# EAGLE design I2C_PWM_DRV_1.0.a (EAGLE 5.10)
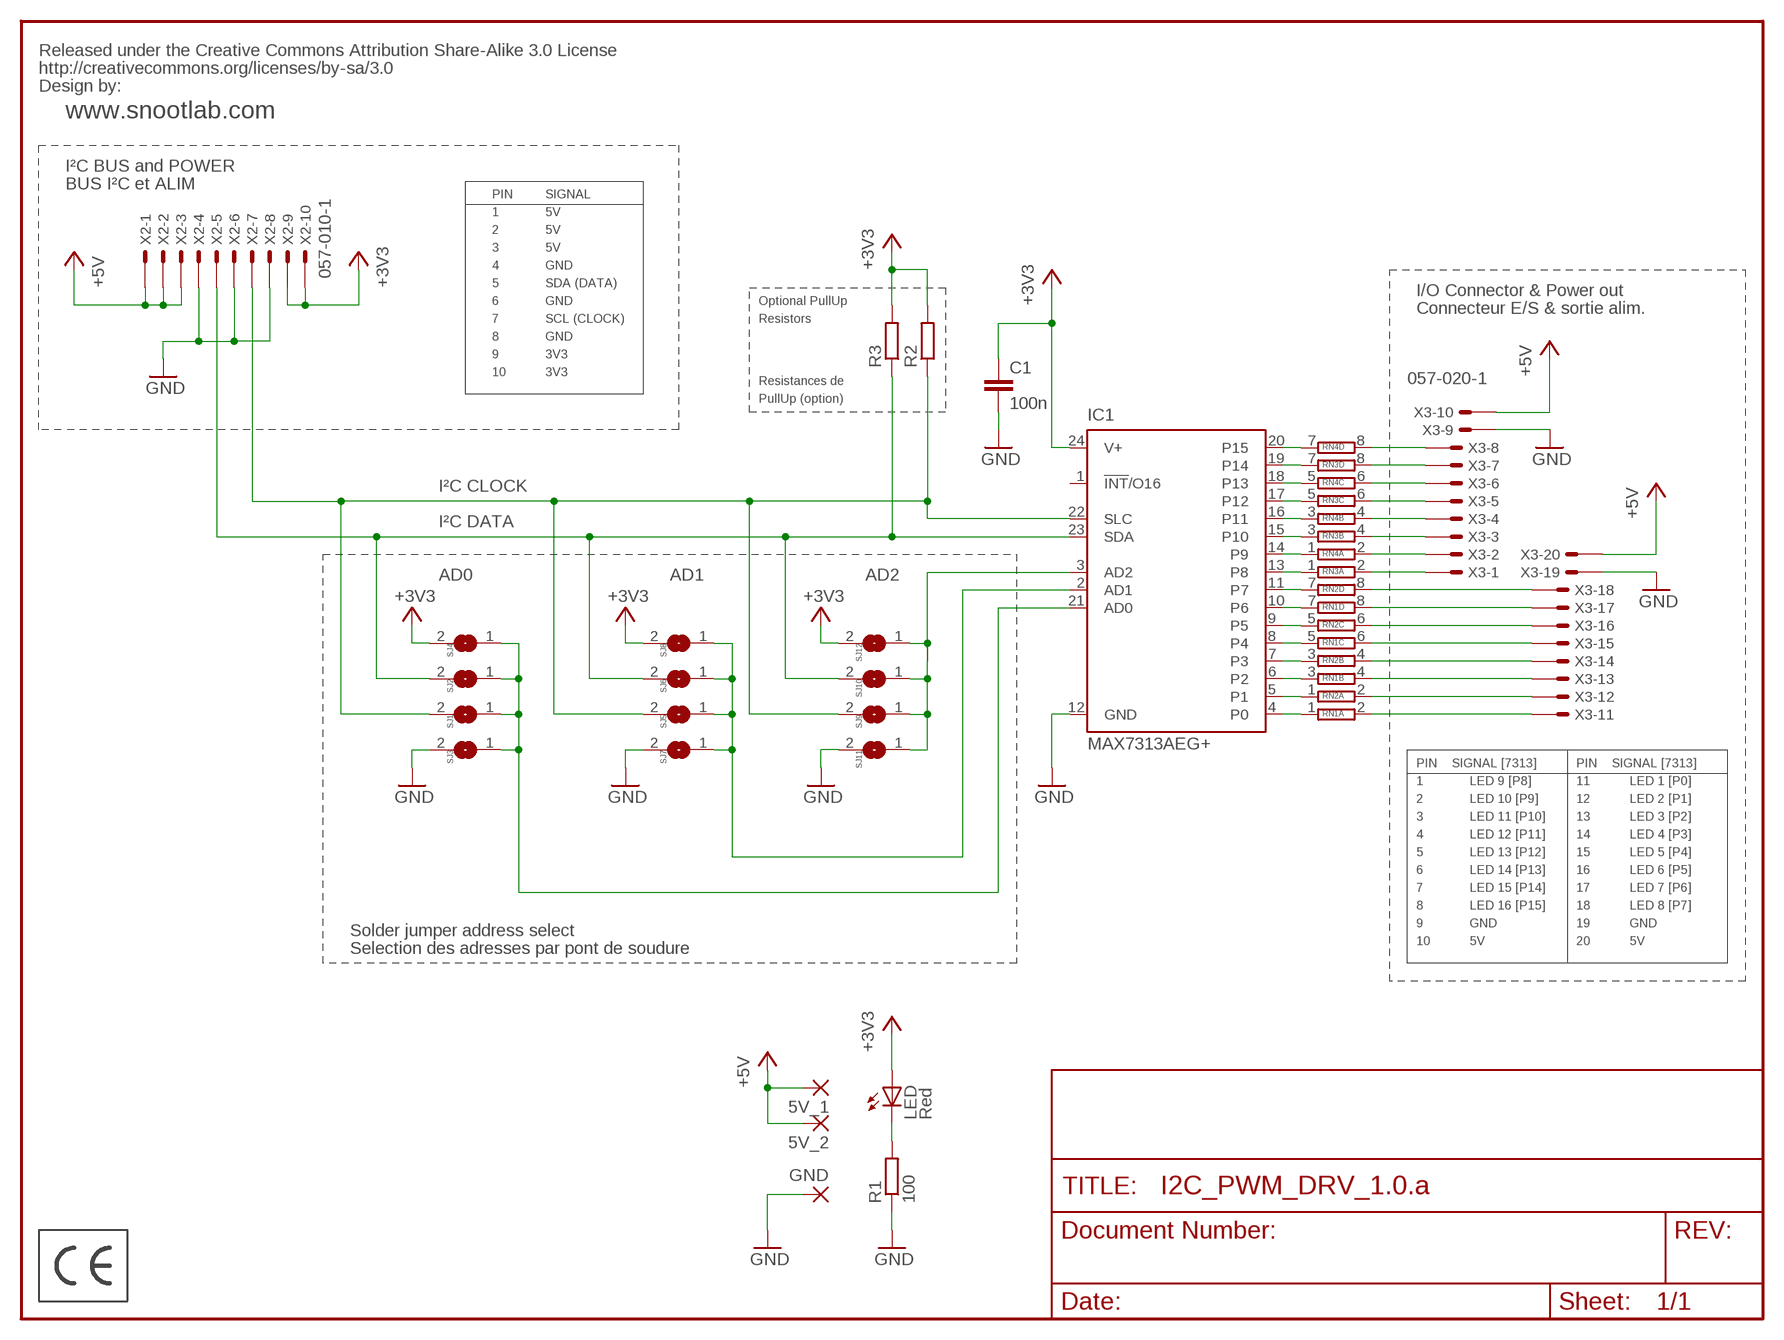
[diagram p0: schematic, sheet 1]

## Parts
5V_1  WIREPAD2,54/0,8  [2,54/0,8]
5V_2  WIREPAD2,54/0,8  [2,54/0,8]
C1  100n  C-EU050-025X075  [C050-025X075]
GND  WIREPAD2,54/0,8  [2,54/0,8]
IC1  MAX7313AEG+  MAX7313AEG  [QSOP24]
LED  Red  LED3MM  [LED3MM]
R1  100  R-EU_0207/2V  [0207/2V]
R2  R-EU_0207/2V  [0207/2V]
R3  R-EU_0207/2V  [0207/2V]
RN1  E4R  [SIL8]
RN2  E4R  [SIL8]
RN3  E4R  [SIL8]
RN4  E4R  [SIL8]
SJ1  SJ  [SJ]
SJ2  SJ  [SJ]
SJ3  SJ  [SJ]
SJ4  SJ  [SJ]
SJ5  SJ  [SJ]
SJ6  SJ  [SJ]
SJ7  SJ  [SJ]
SJ8  SJ  [SJ]
SJ9  SJ  [SJ]
SJ10  SJ  [SJ]
SJ11  SJ  [SJ]
SJ12  SJ  [SJ]
U$3  CE_LOGO  [CE6.35X5.08_TOP]
U$4  CREATIVE_COMMONS  [CREATIVE_COMMONS]
X2  057-010-1  [057-010-1]
X3  057-020-1  [057-020-1]

## Nets
+3V3: C1.1 IC1.24(V+) LED.A R2.2 R3.2 SJ4.2 SJ8.2 SJ12.2 X2.9 X2.10
+5V: 5V_1.1(P) 5V_2.1(P) X2.1 X2.2 X2.3 X3.10 X3.20
AD0: IC1.21(AD0) SJ1.1 SJ2.1 SJ3.1 SJ4.1
AD1: IC1.2(AD1) SJ5.1 SJ6.1 SJ7.1 SJ8.1
AD2: IC1.3(AD2) SJ9.1 SJ10.1 SJ11.1 SJ12.1
GND: C1.2 GND.1(P) IC1.12(GND) R1.1 SJ3.2 SJ7.2 SJ11.2 X2.4 X2.6 X2.8 X3.9 X3.19
N$1: IC1.4(P0) RN1.1
N$2: IC1.6(P2) RN1.3
N$3: IC1.8(P4) RN1.5
N$4: IC1.10(P6) RN1.7
N$5: IC1.5(P1) RN2.1
N$6: IC1.7(P3) RN2.3
N$7: IC1.9(P5) RN2.5
N$8: IC1.11(P7) RN2.7
N$9: IC1.13(P8) RN3.1
N$10: IC1.15(P10) RN3.3
N$11: IC1.17(P12) RN3.5
N$12: IC1.19(P14) RN3.7
N$13: IC1.14(P9) RN4.1
N$14: IC1.16(P11) RN4.3
N$15: IC1.18(P13) RN4.5
N$16: IC1.20(P15) RN4.7
N$17: RN1.2 X3.11
N$18: RN2.2 X3.12
N$19: RN1.4 X3.13
N$20: RN2.4 X3.14
N$21: RN1.6 X3.15
N$22: RN2.6 X3.16
N$23: RN1.8 X3.17
N$24: RN2.8 X3.18
N$25: RN3.2 X3.1
N$26: RN4.2 X3.2
N$27: RN3.4 X3.3
N$28: RN4.4 X3.4
N$29: RN3.6 X3.5
N$30: RN4.6 X3.6
N$31: RN3.8 X3.7
N$32: RN4.8 X3.8
N$33: LED.K(C) R1.2
SCL: IC1.22(SLC) R2.1 SJ1.2 SJ5.2 SJ9.2 X2.7
SDA: IC1.23(SDA) R3.1 SJ2.2 SJ6.2 SJ10.2 X2.5
Unconnected: IC1.1(!INT!/O16)

## Notes on the sheet
- www.snootlab.com
- I²C BUS and POWER
- BUS I²C et ALIM
- PIN | SIGNAL
- 1 | 5V
- 2 | 5V
- 3 | 5V
- 4 | GND
- 5 | SDA (DATA)
- I/O Connector & Power out
- 6 | GND | Optional PullUp
- Connecteur E/S & sortie alim.
- 7 | SCL (CLOCK) | Resistors
- 8 | GND
- 9 | 3V3
- 10 | 3V3
- Resistances de
- PullUp (option)
- I²C CLOCK
- I²C DATA
- AD0 | AD1 | AD2
- PIN | SIGNAL [7313] | PIN | SIGNAL [7313]
- 1 | LED 9 [P8] | 11 | LED 1 [P0]
- 2 | LED 10 [P9] | 12 | LED 2 [P1]
- 3 | LED 11 [P10] | 13 | LED 3 [P2]
- 4 | LED 12 [P11] | 14 | LED 4 [P3]
- 5 | LED 13 [P12] | 15 | LED 5 [P4]
- 6 | LED 14 [P13] | 16 | LED 6 [P5]
- 7 | LED 15 [P14] | 17 | LED 7 [P6]
- 8 | LED 16 [P15] | 18 | LED 8 [P7]
- 9 | GND | 19 | GND
- Solder jumper address select
- 10 | 5V | 20 | 5V
- Selection des adresses par pont de soudure

## Library data of the parts
5V_1 5V_2 GND = wirepad:WIREPAD: Wire PAD connect wire on PCB
C1 = rcl:C-EU: CAPACITOR, European symbol
IC1 = maxim:MAX7313AEG: 16-Port I/O Expander with LED Intensity Control, Interrupt, and Hot-Insertion Protection Source: http://datasheets.maxim-ic.com/en/ds/MAX7313.pdf
LED = led:LED: LED OSRAM: - CHIPLED LG R971, LG N971, LY N971, LG Q971, LY Q971, LO R971, LY R971 LH N974, LH R974 LS Q976, LO Q976, LY Q976 LO Q996 - Hyper CHIPLED LW Q18S LB Q993, LB Q99A, LB R99A - SideLED LS A670, LO A670, LY A670, LG A670, LP A670 LB A673, LV A673, LT A673, LW A673 LH A674 LY A675 LS A676, LA A676, LO A676, LY A676, LW A676 LS A679, LY A679, LG A679 - Hyper Micro SIDELED® LS Y876, LA Y876, LO Y876, LY Y876 LT Y87S - SmartLED LW L88C, LW L88S LB L89C, LB L89S, LG L890 LS L89K, LO L89K, LY L89K LS L896, LA L896, LO L896, LY L896 - TOPLED LS T670, LO T670, LY T670, LG T670, LP T670 LSG T670, LSP T670, LSY T670, LOP T670, LYG T670 LG T671, LOG T671, LSG T671 LB T673, LV T673, LT T673, LW T673 LH T674 LS T676, LA T676, LO T676, LY T676, LB T676, LH T676, LSB T676, LW T676 LB T67C, LV T67C, LT T67C, LS T67K, LO T67K, LY T67K, LW E67C LS E67B, LA E67B, LO E67B, LY E67B, LB E67C, LV E67C, LT E67C LW T67C LS T679, LY T679, LG T679 LS T770, LO T770, LY T770, LG T770, LP T770 LB T773, LV T773, LT T773, LW T773 LH T774 LS E675, LA E675, LY E675, LS T675 LS T776, LA T776, LO T776, LY T776, LB T776 LHGB T686 LT T68C, LB T68C - Hyper Mini TOPLED® LB M676 - Mini TOPLED Santana® LG M470 LS M47K, LO M47K, LY M47K Source: http://www.osram.convergy.de LUXEON: - LUMILED® LXK2-PW12-R00, LXK2-PW12-S00, LXK2-PW14-U00, LXK2-PW14-V00 LXK2-PM12-R00, LXK2-PM12-S00, LXK2-PM14-U00 LXK2-PE12-Q00, LXK2-PE12-R00, LXK2-PE12-S00, LXK2-PE14-T00, LXK2-PE14-U00 LXK2-PB12-K00, LXK2-PB12-L00, LXK2-PB12-M00, LXK2-PB14-N00, LXK2-PB14-P00, LXK2-PB14-Q00 LXK2-PR12-L00, LXK2-PR12-M00, LXK2-PR14-Q00, LXK2-PR14-R00 LXK2-PD12-Q00, LXK2-PD12-R00, LXK2-PD12-S00 LXK2-PH12-R00, LXK2-PH12-S00 LXK2-PL12-P00, LXK2-PL12-Q00, LXK2-PL12-R00 Source: www.luxeon.com KINGBRIGHT: KA-3528ASYC Source: www.kingbright.com
R1-R3 = rcl:R-EU_: RESISTOR, European symbol
RN1-RN4 = resistor-sil:E4R: SIL RESISTOR
SJ1-SJ12 = jumper:SJ: SMD solder JUMPER
U$3 = SnootLib:CE_LOGO: Logo CE
U$4 = SnootLib:CREATIVE_COMMONS
X2 = con-panduit:057-010-: CONNECTOR 10-pin series 057 contact pc board low profile headers
X3 = con-panduit:057-020-: CONNECTOR 20-pin series 057 contact pc board low profile headers

## Board
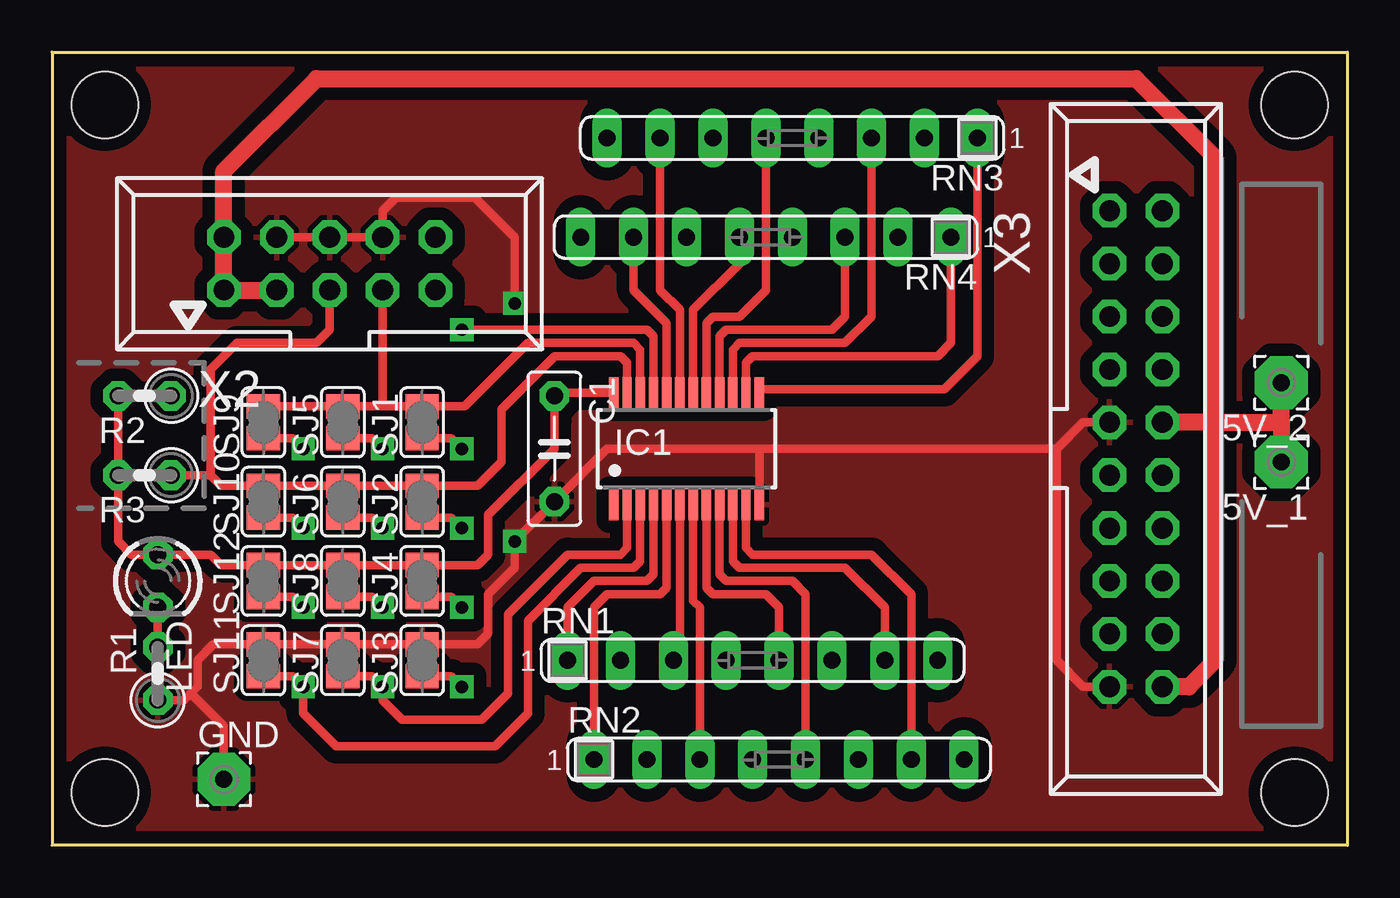
[diagram p1: board, top side]
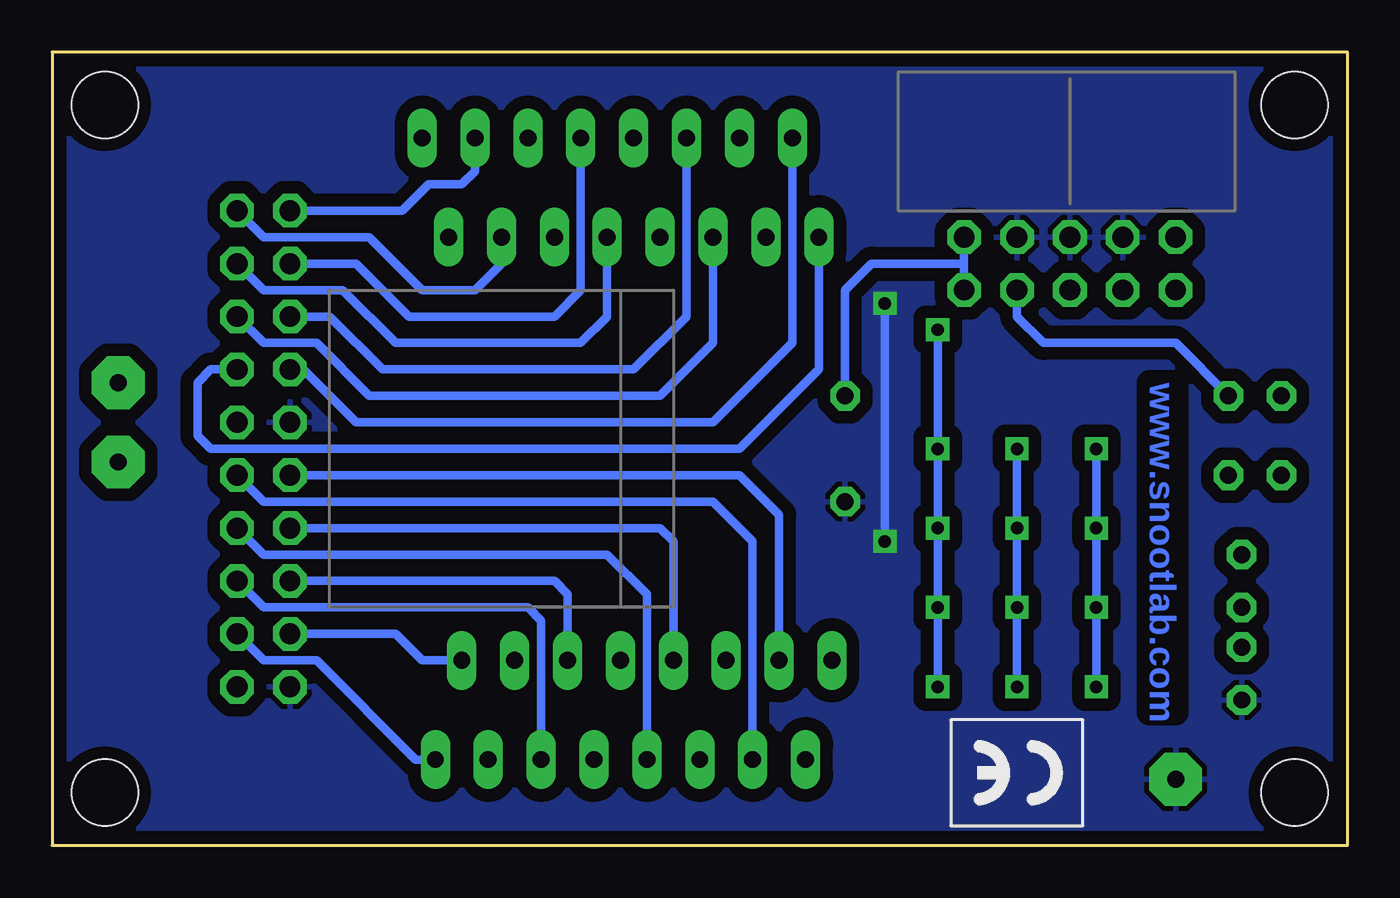
[diagram p2: board, bottom side, seen from below]

Size 62.23 x 38.1 mm. Coordinates in mm from the lower left corner, seen from the top.
Outline: 0,38.1 0,0 62.23,0 62.23,38.1 0,38.1
Copper layers (1*16): Top 0.035mm / dielectric 1.5mm / Bottom 0.035mm
Design rules "SparkFun": minimum track width 8mil, minimum drill 20mil, track to track 8mil, track to pad 8mil, pad to pad 8mil, via to via 8mil, smd to smd 8mil, copper to edge 10mil, drill to drill 8mil, minimum pad ring 12mil, minimum via ring 10mil, stop-mask expansion 4mil, vias tented up to drill 25mil, thermal gap 10mil
Holes 3.2 mm at 2.54,2.54 2.54,35.56 59.69,2.54 59.69,35.56

### Footprints (pad centres in the part's own frame; a part is rotated, then mirrored left to right if it is on the bottom)
2,54/0,8 = drill 0.813 pad 2.54 octagon: 1 0,0
C050-025X075 = drill 0.813 octagon: 1 -2.54,0; 2 2.54,0
QSOP24 = smd 0.45 x 1.5: 1 -3.493,-2.69; 2 -2.857,-2.69; 3 -2.223,-2.69; 4 -1.587,-2.69; 5 -0.953,-2.69; 6 -0.318,-2.69; 7 0.318,-2.69; 8 0.953,-2.69; 9 1.587,-2.69; 10 2.223,-2.69; 11 2.857,-2.69; 12 3.493,-2.69; 13 3.493,2.69; 14 2.857,2.69; 15 2.223,2.69; 16 1.587,2.69; 17 0.953,2.69; 18 0.318,2.69; 19 -0.318,2.69; 20 -0.953,2.69; 21 -1.587,2.69; 22 -2.223,2.69; 23 -2.857,2.69; 24 -3.493,2.69
LED3MM = drill 0.813 octagon: A -1.27,0; K 1.27,0
0207/2V = drill 0.813 octagon: 1 -1.27,0; 2 1.27,0
SIL8 = drill 0.813 long: 1 -8.89,0; 2 -6.35,0; 3 -3.81,0; 4 -1.27,0; 5 1.27,0; 6 3.81,0; 7 6.35,0; 8 8.89,0
SJ = smd 1.168 x 1.6: 1 -0.762,0; 2 0.762,0
057-010-1 = drill 1 octagon: 1 -5.08,-1.27; 2 -5.08,1.27; 3 -2.54,-1.27; 4 -2.54,1.27; 5 0,-1.27; 6 0,1.27; 7 2.54,-1.27; 8 2.54,1.27; 9 5.08,-1.27; 10 5.08,1.27
057-020-1 = drill 1 octagon: 1 -11.43,-1.27; 2 -11.43,1.27; 3 -8.89,-1.27; 4 -8.89,1.27; 5 -6.35,-1.27; 6 -6.35,1.27; 7 -3.81,-1.27; 8 -3.81,1.27; 9 -1.27,-1.27; 10 -1.27,1.27; 11 1.27,-1.27; 12 1.27,1.27; 13 3.81,-1.27; 14 3.81,1.27; 15 6.35,-1.27; 16 6.35,1.27; 17 8.89,-1.27; 18 8.89,1.27; 19 11.43,-1.27; 20 11.43,1.27

### Placement (x,y rotation side)
5V_1  59.05,18.41 180 top
5V_2  59.05,22.23 180 top
C1  24.13,19.05 270 top
GND  8.26,3.17 0 top
IC1  30.48,19.05 0 top
LED  5.08,12.7 270 top
R1  5.08,8.26 90 top
R2  4.45,21.59 180 top
R3  4.45,17.78 180 top
RN1  33.66,8.89 0 top
RN2  34.92,4.13 0 top
RN3  35.56,33.97 180 top
RN4  34.29,29.21 180 top
SJ1  17.78,20.32 90 top
SJ2  17.78,16.51 90 top
SJ3  17.78,8.89 90 top
SJ4  17.78,12.7 90 top
SJ5  13.97,20.32 90 top
SJ6  13.97,16.51 90 top
SJ7  13.97,8.89 90 top
SJ8  13.97,12.7 90 top
SJ9  10.16,20.32 90 top
SJ10  10.16,16.51 90 top
SJ11  10.16,8.89 90 top
SJ12  10.16,12.7 90 top
U$1  [LOGO_SNOOT_FULL_H5]  46.99,7.62 90 top
U$2  [LOGO_SNOOT_H6.35]  60.96,13.97 270 bottom
U$3  12.7,6.03 180 bottom
U$4  10.16,-8.89 0 top  (outside the outline)
X2  13.34,27.94 0 top
X3  52.07,19.05 270 top

### Tracks (layer width: path | path; a pad name or v marks a point on that pad's centre or on a via)
+3V3
  Top 0.406: C1.1 24.13,19.05 20.95,15.88 20.95,13.97 20.45,13.46 SJ4.2 SJ8.2 SJ12.2 8.13,13.46 7.62,13.97 LED.A 3.81,13.97 3.17,14.61 R3.2 R2.2 | IC1.24 25.55,21.74 24.28,21.74 C1.1 | C1.1 24.13,20.32
  Bottom 0.406: 18.41,27.94 X2.9 | 18.41,27.94 X2.10 | C1.1 24.13,26.67 22.86,27.94 18.41,27.94
+5V
  Top 0.813: X2.3 X2.1 X2.2 8.26,32.38 12.7,36.83 52.07,36.83 55.88,33.02 55.88,20.32 | 55.88,20.32 X3.10 | X3.20 54.61,7.62 55.88,8.89 55.88,20.32 | 59.05,20.32 5V_1.1 | 59.05,20.32 5V_2.1 | 55.88,20.32 59.05,20.32
AD0  (via drill 0.6)
  Top 0.406: IC1.21 28.89,24.45 28.57,24.77 v19.68,24.77 | SJ1.1 19.18,19.56 v19.68,19.05 | SJ2.1 19.18,15.75 v19.68,15.24 | SJ4.1 19.18,11.94 v19.68,11.43 | SJ3.1 19.18,8.13 v19.68,7.62
  Bottom 0.406: v19.68,7.62 v19.68,11.43 v19.68,15.24 v19.68,19.05 v19.68,24.77
AD1  (via drill 0.6)
  Top 0.406: SJ5.1 15.37,19.56 v15.88,19.05 | SJ6.1 15.37,15.75 v15.88,15.24 | SJ8.1 15.37,11.94 v15.88,11.43 | SJ7.1 15.37,8.13 v15.88,7.62 15.88,6.99 16.83,6.03 20.64,6.03 21.91,7.3 21.91,11.11 24.77,13.97 27.3,13.97 27.62,14.29 IC1.2
  Bottom 0.406: v15.88,7.62 v15.88,11.43 v15.88,15.24 v15.88,19.05
AD2  (via drill 0.6)
  Top 0.406: SJ9.1 11.56,19.56 v12.06,19.05 | SJ10.1 11.56,15.75 v12.06,15.24 | SJ12.1 11.56,11.94 v12.06,11.43 | SJ11.1 11.56,8.13 v12.06,7.62 12.06,6.35 13.65,4.76 21.27,4.76 22.86,6.35 22.86,10.79 25.4,13.34 27.94,13.34 28.26,13.65 IC1.3
  Bottom 0.406: v12.06,7.62 v12.06,11.43 v12.06,15.24 v12.06,19.05
GND  (via drill 0.6)
  Top 0.406: 6.67,7.3 6.35,6.99 R1.1 | 6.67,7.3 6.99,7.62 6.99,8.89 7.75,9.65 SJ11.2 SJ7.2 SJ3.2 20.45,9.65 20.95,10.16 20.95,12.06 22.23,13.34 v22.23,14.61 C1.2 26.67,19.05 33.97,19.05 | v22.23,26.04 22.23,29.21 20.32,31.11 16.51,31.11 15.88,30.48 X2.8 X2.6 X2.4 | GND.1 8.26,5.71 6.67,7.3 | 33.97,19.05 IC1.12 | 33.97,19.05 48.26,19.05 | 48.26,19.05 49.53,20.32 X3.9 | X3.19 49.53,7.62 48.26,8.89 48.26,19.05
  Bottom 0.406: v22.23,14.61 v22.23,26.04
  pour Bottom (isolate 0.61): 0,38.1 62.23,38.1 62.23,0 0,0
  pour Top (isolate 0.61): 0,38.1 62.23,38.1 62.23,0 0,0
N$1
  Top 0.406: IC1.4 28.89,13.02 28.57,12.7 26.04,12.7 24.77,11.43 RN1.1
N$2
  Top 0.406: IC1.6 30.16,9.21 RN1.3
N$3
  Top 0.406: IC1.8 31.43,12.38 31.75,12.06 34.29,12.06 34.92,11.43 RN1.5
N$4
  Top 0.406: IC1.10 32.7,13.65 33.02,13.34 38.1,13.34 40.01,11.43 RN1.7
N$5
  Top 0.406: IC1.5 29.53,12.38 29.21,12.06 26.67,12.06 26.04,11.43 RN2.1
N$6
  Top 0.406: IC1.7 30.8,11.75 31.11,11.43 RN2.3
N$7
  Top 0.406: IC1.9 32.07,13.02 32.38,12.7 35.56,12.7 36.2,12.06 RN2.5
N$8
  Top 0.406: IC1.11 33.34,14.29 33.66,13.97 39.37,13.97 41.27,12.06 RN2.7
N$9
  Top 0.406: IC1.13 33.97,21.91 42.86,21.91 44.45,23.5 RN3.1
N$10
  Top 0.406: IC1.15 32.7,23.81 33.02,24.13 38.1,24.13 39.37,25.4 RN3.3
N$11
  Top 0.406: IC1.17 31.43,25.08 31.75,25.4 33.02,25.4 34.29,26.67 RN3.5
N$12
  Top 0.406: IC1.19 30.16,25.72 29.21,26.67 RN3.7
N$13
  Top 0.406: IC1.14 33.34,23.18 33.66,23.5 42.55,23.5 43.18,24.13 RN4.1
N$14
  Top 0.406: IC1.16 32.07,24.45 32.38,24.77 37.47,24.77 38.1,25.4 RN4.3
N$15
  Top 0.406: IC1.18 30.8,25.72 33.02,27.94 RN4.5
N$16
  Top 0.406: IC1.20 29.53,25.08 27.94,26.67 RN4.7
N$17
  Bottom 0.406: RN1.2 27.3,15.88 29.21,17.78 X3.11
N$18
  Bottom 0.406: RN2.2 28.57,14.61 30.48,16.51 52.07,16.51 X3.12
N$19
  Bottom 0.406: RN1.4 32.38,14.61 33.02,15.24 X3.13
N$20
  Bottom 0.406: RN2.4 33.66,12.06 35.56,13.97 52.07,13.97 X3.14
N$21
  Bottom 0.406: RN1.6 37.47,12.06 38.1,12.7 X3.15
N$22
  Bottom 0.406: RN2.6 38.73,10.79 39.37,11.43 52.07,11.43 X3.16
N$23
  Bottom 0.406: X3.17 45.72,10.16 44.45,8.89 RN1.8
N$24
  Bottom 0.406: X3.18 52.07,8.89 49.53,8.89 44.77,4.13 RN2.8
N$25
  Bottom 0.406: RN3.2 41.91,32.38 42.55,31.75 44.13,31.75 45.4,30.48 X3.1
N$26
  Bottom 0.406: RN4.2 40.64,27.94 41.91,26.67 44.45,26.67 46.99,29.21 52.07,29.21 X3.2
N$27
  Bottom 0.406: RN3.4 36.83,26.67 38.1,25.4 45.09,25.4 47.62,27.94 X3.3
N$28
  Bottom 0.406: RN4.4 35.56,25.4 36.83,24.13 45.72,24.13 48.26,26.67 52.07,26.67 X3.4
N$29
  Bottom 0.406: RN3.6 31.75,25.4 34.29,22.86 46.35,22.86 48.9,25.4 X3.5
N$30
  Bottom 0.406: RN4.6 30.48,24.13 33.02,21.59 46.99,21.59 49.53,24.13 52.07,24.13 X3.6
N$31
  Bottom 0.406: RN3.8 26.67,24.13 30.48,20.32 47.62,20.32 50.16,22.86 X3.7
N$32
  Bottom 0.406: RN4.8 25.4,22.86 29.21,19.05 54.61,19.05 55.24,19.68 55.24,22.23 54.61,22.86 X3.8
N$33
  Top 0.406: R1.2 LED.K
SCL
  Top 0.406: IC1.22 28.26,23.81 27.94,24.13 22.86,24.13 19.81,21.08 SJ1.2 15.88,21.08 | 15.88,21.08 SJ5.2 SJ9.2 | X2.7 15.88,21.08
  Bottom 0.406: R2.1 8.26,24.13 14.61,24.13 15.88,25.4 X2.7
SDA
  Top 0.406: IC1.23 27.62,23.18 27.3,23.5 24.13,23.5 21.59,20.95 21.59,18.41 20.45,17.27 SJ2.2 SJ6.2 SJ10.2 8.13,17.27 7.62,17.78 | X2.5 13.34,24.77 12.7,24.13 8.89,24.13 7.62,22.86 7.62,17.78 | R3.1 7.62,17.78

### Text on the board
Bottom: www.snootlab.com
tDocu: 15 | 13 | 11 | 9 | I2C Bus & PWR | 1 | 2 | . | . | 16 | 14 | 12 | 10 | . | . | AD2 | AD1 | AD0 | +5V | SCL | Pull-Up | SDA | . | . | + | . | . | 3V3 | 1 | 3 | 5 | 7 | . | . | GND | 19 | 20 | GND | 2 | 4 | 6 | 8 | OUT & PWR | www.snootlab.com
bDocu: [05] SDA | [10] 3V3 | I2C PWM DRV-1.0-2010 | [04] GND | [09] 3V3 | [03] 5V | [08] GND | [02] 5V | [07] SCL | [01] 5V | [06] GND | 1 | 2 | 2 | 10 | 1 | 9 | 01 - LED9 [P8] | 08 - LED16 [P15] | 09 - GND | 10 - +5VDC | 11 - LED1 [P0] | 18 - LED8 [P7] | 19 - GND | 20 - +5VDC | I2C Bus & PWR | . | . | . | . | PIN - SIGNAL | OUT & PWR | +5V | . | . | . | . | 19 | 20